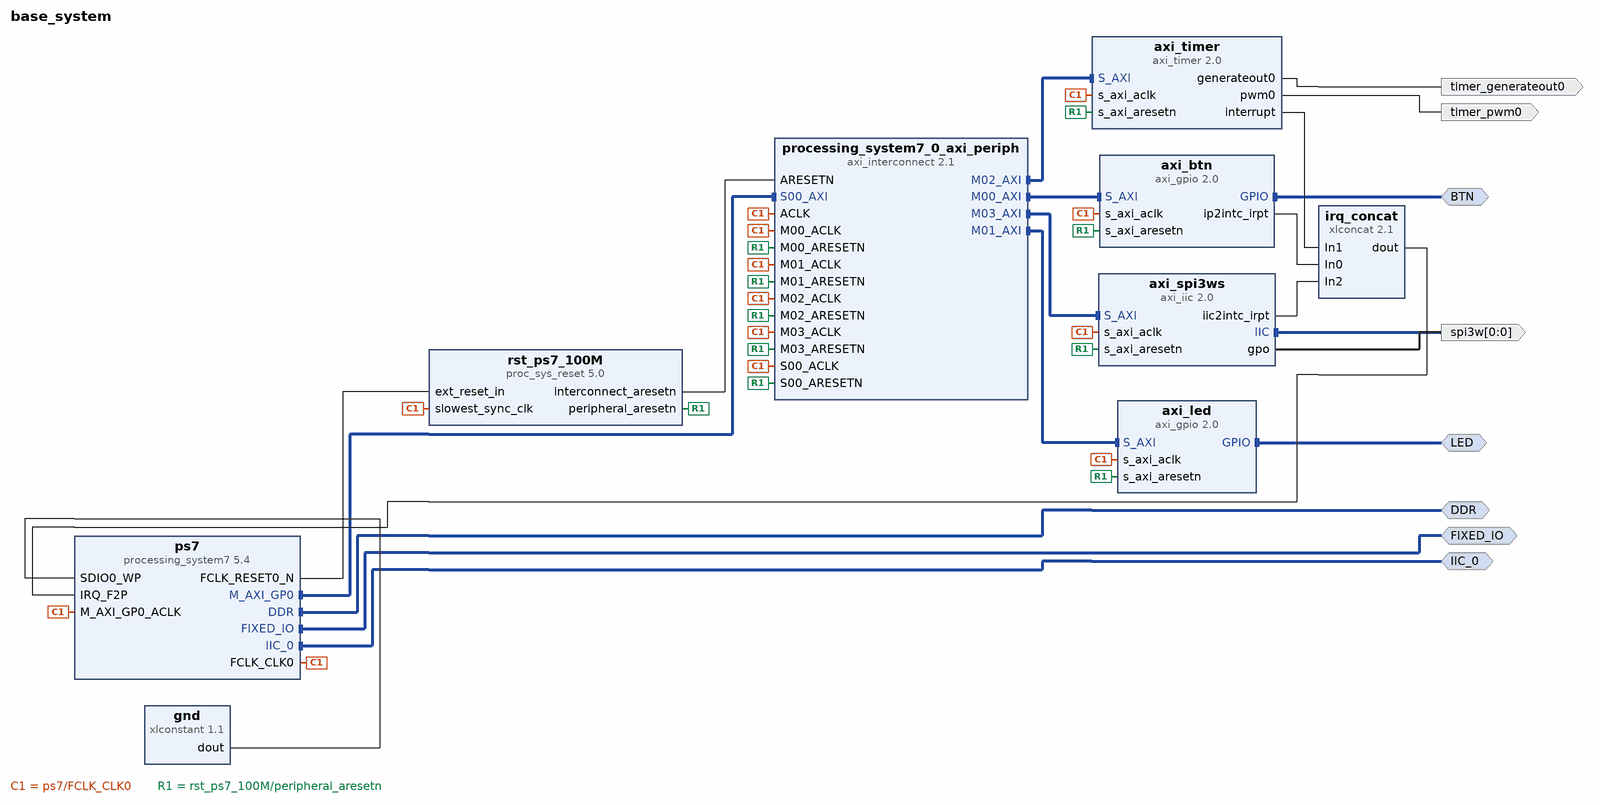
[diagram p0: block diagram of the top level]
# Vivado block design base_system, Vivado 2014.2
create_bd_design base_system

create_bd_intf_port -mode Master -vlnv xilinx.com:interface:ddrx_rtl:1.0 DDR
create_bd_intf_port -mode Master -vlnv xilinx.com:display_processing_system7:fixedio_rtl:1.0 FIXED_IO
create_bd_intf_port -mode Master -vlnv xilinx.com:interface:iic_rtl:1.0 IIC_0
create_bd_intf_port -mode Master -vlnv xilinx.com:interface:gpio_rtl:1.0 LED
create_bd_intf_port -mode Master -vlnv xilinx.com:interface:gpio_rtl:1.0 BTN
create_bd_intf_port -mode Master -vlnv xilinx.com:interface:iic_rtl:1.0 spi3w
create_bd_port -dir O timer_pwm0
create_bd_port -dir O timer_generateout0
create_bd_port -dir O -from 0 -to 0 spi3w

create_bd_cell -type ip -vlnv xilinx.com:ip:processing_system7:5.4 ps7
set_property -dict [list \
  CONFIG.PCW_USE_FABRIC_INTERRUPT 1 \
  CONFIG.PCW_IRQ_F2P_INTR 1 \
  CONFIG.PCW_IMPORT_BOARD_PRESET /home/phil/github/zybo/library/ZYBO_zynq_def.xml \
  CONFIG.PCW_SPI1_PERIPHERAL_ENABLE 1 \
  CONFIG.PCW_SPI1_SPI1_IO {MIO 10 .. 15} \
] [get_bd_cells ps7]
create_bd_cell -type ip -vlnv xilinx.com:ip:xlconstant:1.1 gnd
set_property -dict {CONFIG.CONST_VAL 0} [get_bd_cells gnd]
create_bd_cell -type ip -vlnv xilinx.com:ip:axi_gpio:2.0 axi_btn
set_property -dict {CONFIG.C_GPIO_WIDTH 4 CONFIG.C_ALL_INPUTS 1 CONFIG.C_INTERRUPT_PRESENT 1} [get_bd_cells axi_btn]
create_bd_cell -type ip -vlnv xilinx.com:ip:axi_gpio:2.0 axi_led
set_property -dict {CONFIG.C_GPIO_WIDTH 4 CONFIG.C_ALL_OUTPUTS 1} [get_bd_cells axi_led]
create_bd_cell -type ip -vlnv xilinx.com:ip:axi_interconnect:2.1 processing_system7_0_axi_periph
set_property -dict {CONFIG.NUM_MI 4} [get_bd_cells processing_system7_0_axi_periph]
create_bd_cell -type ip -vlnv xilinx.com:ip:proc_sys_reset:5.0 rst_ps7_100M
create_bd_cell -type ip -vlnv xilinx.com:ip:axi_timer:2.0 axi_timer
create_bd_cell -type ip -vlnv xilinx.com:ip:xlconcat:2.1 irq_concat
set_property -dict {CONFIG.NUM_PORTS 3} [get_bd_cells irq_concat]
create_bd_cell -type ip -vlnv xilinx.com:ip:axi_iic:2.0 axi_spi3ws

# ---- connections ----

connect_bd_intf_net -intf_net processing_system7_0_M_AXI_GP0 [get_bd_intf_pins ps7/M_AXI_GP0] [get_bd_intf_pins processing_system7_0_axi_periph/S00_AXI]
connect_bd_intf_net [get_bd_intf_pins processing_system7_0_axi_periph/M00_AXI] [get_bd_intf_pins axi_btn/S_AXI]
connect_bd_intf_net [get_bd_intf_pins processing_system7_0_axi_periph/M01_AXI] [get_bd_intf_pins axi_led/S_AXI]
connect_bd_intf_net [get_bd_intf_pins processing_system7_0_axi_periph/M02_AXI] [get_bd_intf_pins axi_timer/S_AXI]
connect_bd_intf_net [get_bd_intf_pins processing_system7_0_axi_periph/M03_AXI] [get_bd_intf_pins axi_spi3ws/S_AXI]
connect_bd_intf_net -intf_net processing_system7_0_DDR [get_bd_intf_ports DDR] [get_bd_intf_pins ps7/DDR]
connect_bd_intf_net -intf_net processing_system7_0_FIXED_IO [get_bd_intf_ports FIXED_IO] [get_bd_intf_pins ps7/FIXED_IO]
connect_bd_intf_net -intf_net processing_system7_0_IIC_0 [get_bd_intf_ports IIC_0] [get_bd_intf_pins ps7/IIC_0]
connect_bd_intf_net -intf_net led_GPIO [get_bd_intf_ports LED] [get_bd_intf_pins axi_led/GPIO]
connect_bd_intf_net -intf_net button_GPIO [get_bd_intf_ports BTN] [get_bd_intf_pins axi_btn/GPIO]
connect_bd_intf_net -intf_net axi_iic_0_IIC [get_bd_intf_ports spi3w] [get_bd_intf_pins axi_spi3ws/IIC]
connect_bd_net -net processing_system7_0_FCLK_CLK0 [get_bd_pins ps7/FCLK_CLK0] \
  [get_bd_pins ps7/M_AXI_GP0_ACLK] [get_bd_pins processing_system7_0_axi_periph/S00_ACLK] \
  [get_bd_pins rst_ps7_100M/slowest_sync_clk] [get_bd_pins processing_system7_0_axi_periph/ACLK] \
  [get_bd_pins axi_btn/s_axi_aclk] [get_bd_pins processing_system7_0_axi_periph/M00_ACLK] [get_bd_pins axi_led/s_axi_aclk] \
  [get_bd_pins processing_system7_0_axi_periph/M01_ACLK] [get_bd_pins axi_timer/s_axi_aclk] \
  [get_bd_pins processing_system7_0_axi_periph/M02_ACLK] [get_bd_pins axi_spi3ws/s_axi_aclk] \
  [get_bd_pins processing_system7_0_axi_periph/M03_ACLK]
connect_bd_net [get_bd_pins gnd/dout] [get_bd_pins ps7/SDIO0_WP]
connect_bd_net -net processing_system7_0_FCLK_RESET0_N [get_bd_pins ps7/FCLK_RESET0_N] [get_bd_pins rst_ps7_100M/ext_reset_in]
connect_bd_net -net rst_processing_system7_0_100M_peripheral_aresetn [get_bd_pins rst_ps7_100M/peripheral_aresetn] \
  [get_bd_pins processing_system7_0_axi_periph/S00_ARESETN] [get_bd_pins axi_btn/s_axi_aresetn] \
  [get_bd_pins processing_system7_0_axi_periph/M00_ARESETN] [get_bd_pins axi_led/s_axi_aresetn] \
  [get_bd_pins processing_system7_0_axi_periph/M01_ARESETN] [get_bd_pins axi_timer/s_axi_aresetn] \
  [get_bd_pins processing_system7_0_axi_periph/M02_ARESETN] [get_bd_pins axi_spi3ws/s_axi_aresetn] \
  [get_bd_pins processing_system7_0_axi_periph/M03_ARESETN]
connect_bd_net -net rst_processing_system7_0_100M_interconnect_aresetn [get_bd_pins rst_ps7_100M/interconnect_aresetn] \
  [get_bd_pins processing_system7_0_axi_periph/ARESETN]
connect_bd_net [get_bd_pins axi_btn/ip2intc_irpt] [get_bd_pins irq_concat/In0]
connect_bd_net -net axi_timer_0_pwm0 [get_bd_pins axi_timer/pwm0] [get_bd_ports timer_pwm0]
connect_bd_net -net axi_timer_0_generateout0 [get_bd_pins axi_timer/generateout0] [get_bd_ports timer_generateout0]
connect_bd_net -net axi_timer_0_interrupt [get_bd_pins axi_timer/interrupt] [get_bd_pins irq_concat/In1]
connect_bd_net -net axi_iic_0_gpo [get_bd_pins axi_spi3ws/gpo] [get_bd_ports spi3w]
connect_bd_net -net axi_iic_0_iic2intc_irpt [get_bd_pins axi_spi3ws/iic2intc_irpt] [get_bd_pins irq_concat/In2]
connect_bd_net -net xlconcat_0_dout [get_bd_pins irq_concat/dout] [get_bd_pins ps7/IRQ_F2P]

# ---- address map ----
assign_bd_address -offset 0x41200000 -range 64K -target_address_space [get_bd_addr_spaces ps7/Data] [get_bd_addr_segs axi_btn/S_AXI/Reg]
assign_bd_address -offset 0x41210000 -range 64K -target_address_space [get_bd_addr_spaces ps7/Data] [get_bd_addr_segs axi_led/S_AXI/Reg]
assign_bd_address -offset 0x41600000 -range 64K -target_address_space [get_bd_addr_spaces ps7/Data] [get_bd_addr_segs axi_spi3ws/S_AXI/Reg]
assign_bd_address -offset 0x42800000 -range 64K -target_address_space [get_bd_addr_spaces ps7/Data] [get_bd_addr_segs axi_timer/S_AXI/Reg]

validate_bd_design
save_bd_design
